# Altium project LPCB229__RLOOP__CURRENT_MEASURE.PrjPCB
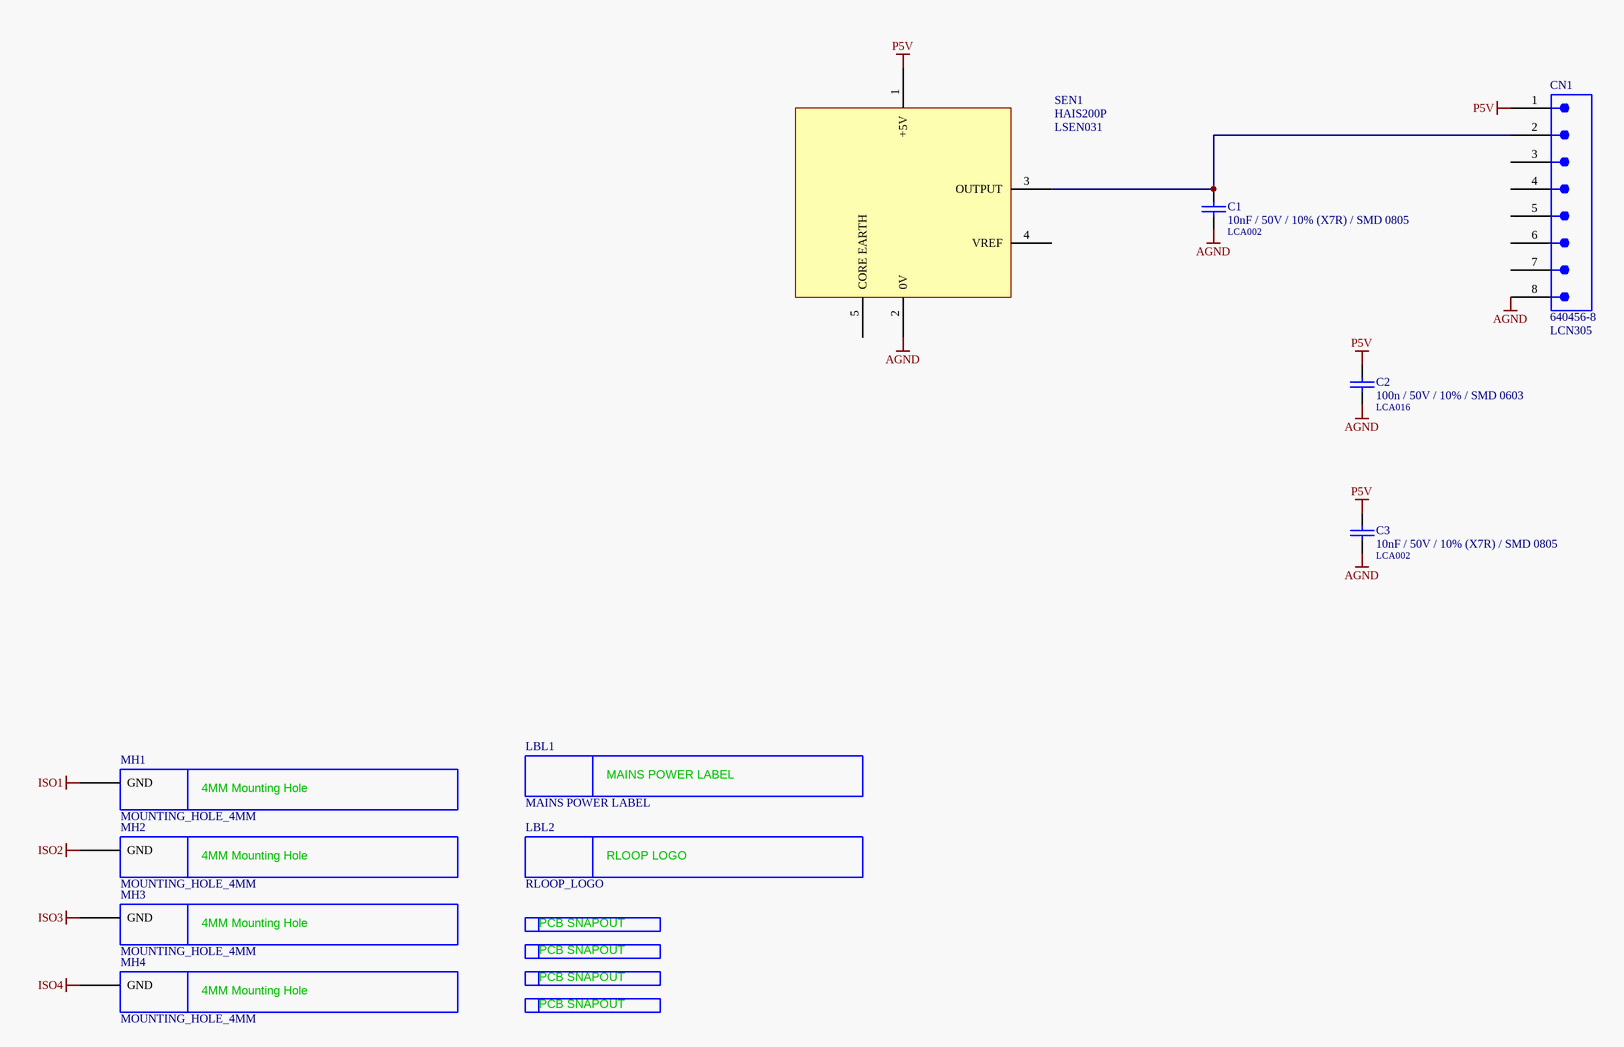
[diagram p0: LPCB229 - TOP.SchDoc]
1 sheet, 15 parts. Net scope: global (net labels, ports and power ports of the same name join across sheets).
Board files: LPCB229R0.PcbDoc, LPCB229R0__ASCII.PcbDoc

## Sheet LPCB229 - TOP.SchDoc
size A3; Address1: Factory 10; Address2: 9-13 Dingley Avenue, Dandeong, VICTORIA 3175, AUSTRALIA; DocumentNumber: 1; Revision: 1; SheetNumber: 1; SheetTotal: 1; Lockie__PCB_SUB_ASSEMBLY: Current Sensor; Lockie__PCB_ASSEMBLY: Current Sensor; Lockie__LDL: LPCB229; Lockie__PCB_DESCRIPTION: HV Current Sensor

### Parts
C1  10nF / 50V / 10% (X7R) / SMD 0805  LDL_NUMBER: LCA002  [LFP010__CC2012-0805-IPC7351_B]
C2  100n / 50V / 10% / SMD 0603  LDL_NUMBER: LCA016  [LFP011__CC1608-0603-IPC7351_B]
C3  10nF / 50V / 10% (X7R) / SMD 0805  LDL_NUMBER: LCA002  [LFP010__CC2012-0805-IPC7351_B]
CN1  640456-8  LDL_NUMBER: LCN305  [640456-8]
LBL1  MAINS POWER LABEL  [MAINS POWER LABEL]  (no BOM)
LBL2  RLOOP_LOGO  [RLOOP_LOGO]  (no BOM)
MH1  MOUNTING_HOLE_4MM  [MOUNTING_HOLE_4MM]  (no BOM)
MH2  MOUNTING_HOLE_4MM  [MOUNTING_HOLE_4MM]  (no BOM)
MH3  MOUNTING_HOLE_4MM  [MOUNTING_HOLE_4MM]  (no BOM)
MH4  MOUNTING_HOLE_4MM  [MOUNTING_HOLE_4MM]  (no BOM)
SEN1  HAIS200P  LDL_NUMBER: LSEN031  [HAIS200P]
SN1  PCB_SNAPOUT  [SNAPOUT_NEW]  (value not drawn)  (no BOM)
SN2  PCB_SNAPOUT  [SNAPOUT_NEW]  (value not drawn)  (no BOM)
SN3  PCB_SNAPOUT  [SNAPOUT_NEW]  (value not drawn)  (no BOM)
SN4  PCB_SNAPOUT  [SNAPOUT_NEW]  (value not drawn)  (no BOM)

### Nets
AGND: C1.2 C2.2 C3.2 CN1.8 SEN1.2(0V)
ISO1: MH1.MOUNT(GND)
ISO2: MH2.MOUNT(GND)
ISO3: MH3.MOUNT(GND)
ISO4: MH4.MOUNT(GND)
P5V: C2.1 C3.1 CN1.1 SEN1.1(+5V)
NetC1_1: C1.1 CN1.2 SEN1.3(OUTPUT)

Not connected (* = marked no-connect by the designer): CN1 3 4 5 6 7; SEN1 4(VREF) 5(CORE_EARTH)

### Notes on the sheet
- PCB COMPONENT DESCRIPTION
- LDL NUMBER
- Assembly Details
- Size
- Drawing File Name
- Revision
- http://rloop.org
- Scale
- A3
- Sheet Details
- N.T.S
- Sheet:
- Of:
- (in symbol MOUNTING_HOLE_4MM) 4MM Mounting Hole
- (in symbol PCB_SNAPOUT) PCB SNAPOUT
- (in symbol RLOOP_LOGO) RLOOP LOGO

### Library data of the parts
C1 C3 = 10nF / 50V / 10% (X7R) / SMD 0805: Capacitor, Ceramic Chip, 10nF (0.01uF), 50V, 10% (X7R), SMD 0805 [LCA002]; Value: 10n; FMEDA__OPERATING__TEMP_MAX: 50; FMEDA__OPERATING__TEMP_MIN: -20; FMEDA__OPERATING__TEMP_TYP: 27; FMEDA__OPERATING__VOLTAGE_MAX: 0; FMEDA__CHANNEL: COM; FMEDA__FUNCTION_IN_SYSTEM: *; FMEDA__OPERATING__VOLTAGE_MIN: 0; FMEDA__OPERATING__VOLTAGE_TYP: 0
C2 = 100n / 50V / 10% / SMD 0603: Capacitor, Ceramic Chip, 100nF (0.1uF), 50V, 5%, SMD 0603 [LCA016]; FMEDA__OPERATING__VOLTAGE_MIN: 0; FMEDA__OPERATING__VOLTAGE_MAX: 3.3; FMEDA__OPERATING__TEMP_MIN: -20; FMEDA__OPERATING__TEMP_TYP: 27; FMEDA__OPERATING__TEMP_MAX: 50; FMEDA__CHANNEL: COM; Value: 100n; FMEDA__FUNCTION_IN_SYSTEM: *; FMEDA__OPERATING__VOLTAGE_TYP: 3.3
CN1 = 640456-8: Connector, Male Header, 8 Way; FMEDA__CHANNEL: COM; FMEDA__OPERATING__CURRENT_MAX: 0; FMEDA__OPERATING__TEMP_MAX: 50; FMEDA__OPERATING__TEMP_MIN: -20; FMEDA__OPERATING__TEMP_TYP: 27; FMEDA__OPERATING__VOLTAGE_MAX: 16; FMEDA__OPERATING__VOLTAGE_TYP: 12; FMEDA__FUNCTION_IN_SYSTEM: *; FMEDA__OPERATING__CURRENT_MIN: 0; FMEDA__OPERATING__CURRENT_TYP: 0; FMEDA__OPERATING__VOLTAGE_MIN: 0
LBL1 = MAINS POWER LABEL: FMEDA__CHANNEL: DIAG; FMEDA__FUNCTION_IN_SYSTEM: *
LBL2 = RLOOP_LOGO: FMEDA__CHANNEL: DIAG; FMEDA__FUNCTION_IN_SYSTEM: *
MH1-MH4 = MOUNTING_HOLE_4MM: 4MM Mouting Hole; FMEDA__CHANNEL: DIAG; FMEDA__FUNCTION_IN_SYSTEM: *
SEN1 = HAIS200P: Hall Current Sensor, 200A Nominal, 600A Max
SN1-SN4 = PCB_SNAPOUT: FMEDA__CHANNEL: DIAG; FMEDA__FUNCTION_IN_SYSTEM: *